# EAGLE design led-er-v3-module-c (EAGLE 7.5.0)
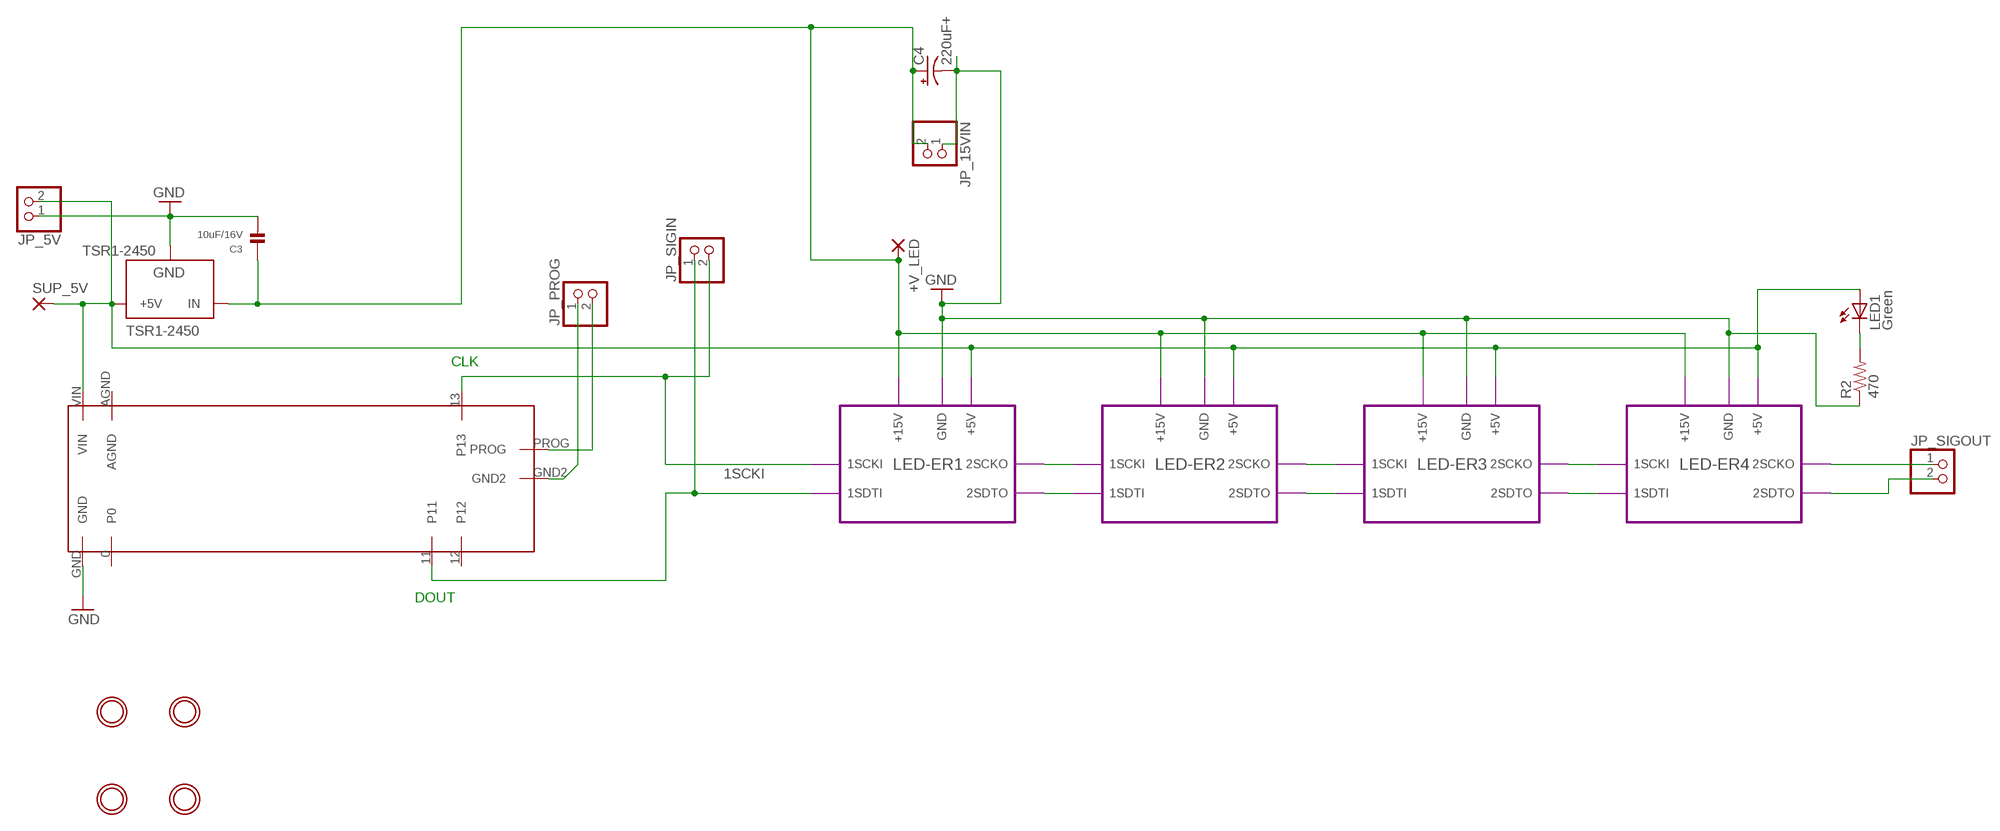
[diagram p0: schematic, sheet 1]

## Parts
+V_LED  3,17/1,1  [3,17/1,1]
C3  10uF/16V  CAP_CERAMIC0805  [0805]
C4  220uF+  CPOL-USE5-8.5  [E5-8,5]
JP_5V  HEADER-1X2  [1X02_OVAL]
JP_15VIN  HEADER-1X2  [1X02_OVAL]
JP_PROG  HEADER-1X2  [1X02_OVAL]
JP_SIGIN  HEADER-1X2  [1X02_OVAL]
JP_SIGOUT  HEADER-1X2  [1X02_OVAL]
LED1  Green  LED5MM  [LED5MM]
R2  470  RESISTOR_DUAL  [0805-THM]
SUP_5V  3,17/1,1  [3,17/1,1]
TSR1-2450  TSR1-2450  [TSR-1]
U$1  MOUNTINGHOLE  [MOUNTINGHOLE_3.0_PLATED]
U$2  MOUNTINGHOLE  [MOUNTINGHOLE_3.0_PLATED]
U$3  MOUNTINGHOLE  [MOUNTINGHOLE_3.0_PLATED]
U$4  MOUNTINGHOLE  [MOUNTINGHOLE_3.0_PLATED]
U$5  TEENSY_LEDER  [TEENSY_LEDER]

## Module instances
LED-ER1 = LED-ER
LED-ER2 = LED-ER
LED-ER3 = LED-ER
LED-ER4 = LED-ER

## Nets
1SCKI: JP_SIGIN.2 U$5.13 ; port LED-ER1.1SCKI
1SDTI: JP_SIGIN.1 U$5.11 ; port LED-ER1.1SDTI
+5V: JP_5V.2 LED1.A SUP_5V.1(P) TSR1-2450.3(+5V) U$5.VIN ; port LED-ER1.+5V LED-ER2.+5V LED-ER3.+5V LED-ER4.+5V
GND: C3.2 C4.- JP_5V.1 JP_15VIN.1 R2.1 TSR1-2450.2(GND) U$5.GND ; port LED-ER1.GND LED-ER2.GND LED-ER3.GND LED-ER4.GND
N$1: LED1.K(C) R2.2
N$2: port LED-ER1.2SCKO LED-ER2.1SCKI
N$3: port LED-ER1.2SDTO LED-ER2.1SDTI
N$4: port LED-ER2.2SCKO LED-ER3.1SCKI
N$5: port LED-ER2.2SDTO LED-ER3.1SDTI
N$6: port LED-ER3.2SCKO LED-ER4.1SCKI
N$7: port LED-ER3.2SDTO LED-ER4.1SDTI
N$8: JP_SIGOUT.1 ; port LED-ER4.2SCKO
N$9: JP_SIGOUT.2 ; port LED-ER4.2SDTO
N$54: JP_PROG.1 U$5.GND2
N$55: JP_PROG.2 U$5.PROG
VIN: +V_LED.1(P) C3.1 C4.+ JP_15VIN.2 TSR1-2450.1(IN) ; port LED-ER1.+15V LED-ER2.+15V LED-ER3.+15V LED-ER4.+15V
Unconnected: U$5.0 U$5.12 U$5.AGND

## Notes on the sheet
- CLK
- DOUT

## Library data of the parts
+V_LED SUP_5V = wirepad:3,17/1,1: THROUGH-HOLE PAD
C3 = microbuilder:CAP_CERAMIC: Ceramic Capacitors 0402 - 0402 Surface Mount Capacitors 16pF 50V 5% [Digikey: 445-4899-2-ND] 18pF 50V 5% [Digikey: 490-1281-2-ND] 22pF 50V 5% [Digikey: 490-1283-2-ND] 68pF 50V 5% [Digikey: 490-1289-2-ND] 0.1uF 10V 10% [Digikey: 490-1318-2-ND] 1.0uF 6.3V 10% [Digikey: 490-1320-2-ND] 0603 - 0603 Surface Mount Capacitors 16 pF 50V 5% [Digikey: 445-5051-2-ND] 22 pF 50V [Digikey: PCC220ACVTR-ND] 33 pF 50V 5% [Digikey: 490-1415-1-ND] 56pF 50V 5% [Digikey: 490-1421-1-ND] 220pF 50V 5% [Digikey: 445-1285-1-ND] 680 pF 50V 2200 pF 50V 5% C0G [Digikey: 445-1297-1-ND] 5600 pF 100V 5% X7R [Digikey: 478-3711-1-ND] 0.1 µF 25V 10% [Digikey: PCC2277TR-ND] 0.22 µF 16V 10% X7R [Digikey: 445-1318-1-ND] 1.0 µF 25V 10% [Digikey: 445-5146-2-ND] 0603 - RF Specific 3pF 250V +/-0.1pF RF [Digikey: 712-1347-1-ND] 18 pF 250V 5% [Digikey: 478-3505-1-ND or 712-1322-1-ND] 56 pF 250V 5% C0G RF [Digikey: 490-4867-1-ND] 68 pF 250V RF [Digikey: 490-4868-1-ND] 0805 - 0805 Surface Mount Capacitors 220 pF 250V 2% RF Ceramic Capacitor [Digikey: 712-1398-1-ND] 1000 pF 50V 2% NP0 Ceramic Capacitor [Digikey: 478-3760-1-ND] 0.1 µF 25V 10% Ceramic Capacitor [Digikey: PCC1828TR-ND] 1.0 µF 16V 10% Ceramic Capacitor[Digikey: 490-1691-2-ND] 10.0 µF 10V 10% Ceramic Capacitor[Digikey: 709-1228-1-ND] 10.0 uF 16V 10% Ceramic Capacitor [Digikey: 478-5165-2-ND] 47 uF 6.3V 20% Ceramic Capacitor [Digikey: 587-1779-1-ND or 399-5506-1-ND] 1206 - 1206 Surface Mount Capacitors 47uF 10V 20% Ceramic Capacitor [Digikey: 490-5528-1-ND or 399-5508-1-ND or 445-6010-1-ND] 100uF 6.3V -20%, +80% Y5V Ceramic Capacitor (Digikey: 490-4512-1-ND, Mouser: 81-GRM31CF50J107ZE1L)
C4 = adafruit:CPOL-US: POLARIZED CAPACITOR, American symbol
JP_5V JP_15VIN JP_PROG JP_SIGIN JP_SIGOUT = microbuilder:HEADER-1X2: PIN HEADER
LED1 = adafruit:LED: LED OSRAM: - CHIPLED LG R971, LG N971, LY N971, LG Q971, LY Q971, LO R971, LY R971 LH N974, LH R974 LS Q976, LO Q976, LY Q976 LO Q996 - Hyper CHIPLED LW Q18S LB Q993, LB Q99A, LB R99A - SideLED LS A670, LO A670, LY A670, LG A670, LP A670 LB A673, LV A673, LT A673, LW A673 LH A674 LY A675 LS A676, LA A676, LO A676, LY A676, LW A676 LS A679, LY A679, LG A679 - Hyper Micro SIDELED® LS Y876, LA Y876, LO Y876, LY Y876 LT Y87S - SmartLED LW L88C, LW L88S LB L89C, LB L89S, LG L890 LS L89K, LO L89K, LY L89K LS L896, LA L896, LO L896, LY L896 - TOPLED LS T670, LO T670, LY T670, LG T670, LP T670 LSG T670, LSP T670, LSY T670, LOP T670, LYG T670 LG T671, LOG T671, LSG T671 LB T673, LV T673, LT T673, LW T673 LH T674 LS T676, LA T676, LO T676, LY T676, LB T676, LH T676, LSB T676, LW T676 LB T67C, LV T67C, LT T67C, LS T67K, LO T67K, LY T67K, LW E67C LS E67B, LA E67B, LO E67B, LY E67B, LB E67C, LV E67C, LT E67C LW T67C LS T679, LY T679, LG T679 LS T770, LO T770, LY T770, LG T770, LP T770 LB T773, LV T773, LT T773, LW T773 LH T774 LS E675, LA E675, LY E675, LS T675 LS T776, LA T776, LO T776, LY T776, LB T776 LHGB T686 LT T68C, LB T68C - Hyper Mini TOPLED® LB M676 - Mini TOPLED Santana® LG M470 LS M47K, LO M47K, LY M47K Source: http://www.osram.convergy.de/
R2 = microbuilder:RESISTOR_DUAL: Flip Flop resistor An 0805 resistor inside a standard 1/4W 5% resistor. Makes for easy mods Footprint taken from the Adafruit Industries Eagle Library.
TSR1-2450 = SteelCaveRobotics-Power:TSR1-2450: Traco Power TSR 1-2450 5.0v switching regulator
U$1-U$4 = microbuilder:MOUNTINGHOLE: Mounting Hole For #2 screws (0.086"/2.18mm width, 0.094"/2.4mm hole) use 2.5mm
U$5 = Andrews:TEENSY_LEDER

## Module LED-ER
Ports: 1SCKI(io) 1SDTI(io) 2SCKO(io) 2SDTO(io) +15V(io) GND(io) +5V(io)
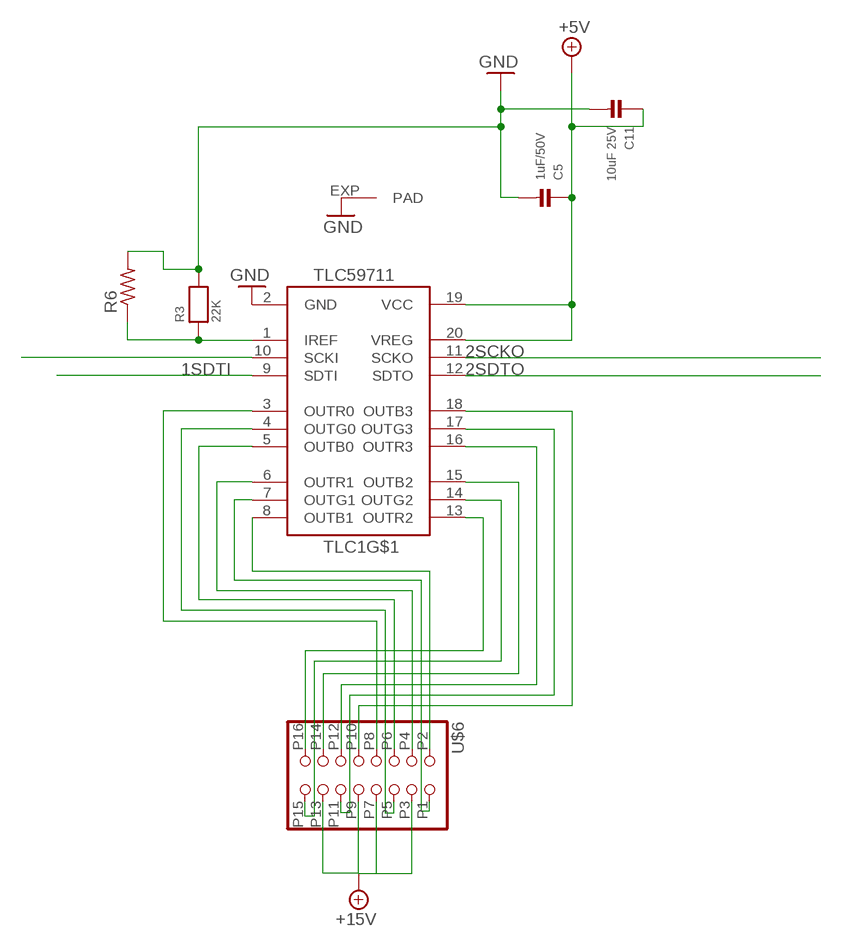
[diagram p1: schematic, module LED-ER, sheet 1]

### Parts
C5  1uF/50V  CAP_CERAMIC0805  [0805]
C11  10uF 25V  CAP_CERAMIC0805  [0805]
R3  22K  RESISTOR0805  [0805]
R6  R-US_0207/9  [0207/9]
TLC1  TLC59711  [HTSSOP20DAP]
U$6  HEADER-2X8-RIBBON  [2X08_RIBBON]

### Nets
1SCKI: TLC1.10(SCKI)
1SDTI: TLC1.9(SDTI)
2SCKO: TLC1.11(SCKO)
2SDTO: TLC1.12(SDTO)
+5V: C5.1 C11.1 TLC1.19(VCC) TLC1.20(VREG)
+15V: U$6.P3 U$6.P7 U$6.P9 U$6.P13
B0: TLC1.5(OUTB0) U$6.P6
B1: TLC1.8(OUTB1) U$6.P2
B2: TLC1.15(OUTB2) U$6.P14
B3: TLC1.18(OUTB3) U$6.P10
G0: TLC1.4(OUTG0) U$6.P5
G1: TLC1.7(OUTG1) U$6.P1
G2: TLC1.14(OUTG2) U$6.P15
G3: TLC1.17(OUTG3) U$6.P11
GND: C5.2 C11.2 R3.2 R6.2 TLC1.2(GND) TLC1.EXP(PAD)
IREF: R3.1 R6.1 TLC1.1(IREF)
R0: TLC1.3(OUTR0) U$6.P8
R1: TLC1.6(OUTR1) U$6.P4
R2: TLC1.13(OUTR2) U$6.P16
R3: TLC1.16(OUTR3) U$6.P12

### Library data of the parts
C5 C11 = microbuilder:CAP_CERAMIC: Ceramic Capacitors 0402 - 0402 Surface Mount Capacitors 16pF 50V 5% [Digikey: 445-4899-2-ND] 18pF 50V 5% [Digikey: 490-1281-2-ND] 22pF 50V 5% [Digikey: 490-1283-2-ND] 68pF 50V 5% [Digikey: 490-1289-2-ND] 0.1uF 10V 10% [Digikey: 490-1318-2-ND] 1.0uF 6.3V 10% [Digikey: 490-1320-2-ND] 0603 - 0603 Surface Mount Capacitors 16 pF 50V 5% [Digikey: 445-5051-2-ND] 22 pF 50V [Digikey: PCC220ACVTR-ND] 33 pF 50V 5% [Digikey: 490-1415-1-ND] 56pF 50V 5% [Digikey: 490-1421-1-ND] 220pF 50V 5% [Digikey: 445-1285-1-ND] 680 pF 50V 2200 pF 50V 5% C0G [Digikey: 445-1297-1-ND] 5600 pF 100V 5% X7R [Digikey: 478-3711-1-ND] 0.1 µF 25V 10% [Digikey: PCC2277TR-ND] 0.22 µF 16V 10% X7R [Digikey: 445-1318-1-ND] 1.0 µF 25V 10% [Digikey: 445-5146-2-ND] 0603 - RF Specific 3pF 250V +/-0.1pF RF [Digikey: 712-1347-1-ND] 18 pF 250V 5% [Digikey: 478-3505-1-ND or 712-1322-1-ND] 56 pF 250V 5% C0G RF [Digikey: 490-4867-1-ND] 68 pF 250V RF [Digikey: 490-4868-1-ND] 0805 - 0805 Surface Mount Capacitors 220 pF 250V 2% RF Ceramic Capacitor [Digikey: 712-1398-1-ND] 1000 pF 50V 2% NP0 Ceramic Capacitor [Digikey: 478-3760-1-ND] 0.1 µF 25V 10% Ceramic Capacitor [Digikey: PCC1828TR-ND] 1.0 µF 16V 10% Ceramic Capacitor[Digikey: 490-1691-2-ND] 10.0 µF 10V 10% Ceramic Capacitor[Digikey: 709-1228-1-ND] 10.0 uF 16V 10% Ceramic Capacitor [Digikey: 478-5165-2-ND] 47 uF 6.3V 20% Ceramic Capacitor [Digikey: 587-1779-1-ND or 399-5506-1-ND] 1206 - 1206 Surface Mount Capacitors 47uF 10V 20% Ceramic Capacitor [Digikey: 490-5528-1-ND or 399-5508-1-ND or 445-6010-1-ND] 100uF 6.3V -20%, +80% Y5V Ceramic Capacitor (Digikey: 490-4512-1-ND, Mouser: 81-GRM31CF50J107ZE1L)
R3 = microbuilder:RESISTOR: Resistors 0402 - 0402 Surface Mount Package 22 Ohm 1% 1/16W [Digikey: 311-22.0LRTR-ND] 33 Ohm 5% 1/16W 1.0K 5% 1/16W 1.5K 5% 1/16W 2.0K 1% 1/16W 10.0K 1% 1/16W [Digikey: 311-10.0KLRTR-ND] 10.0K 5% 1/16W [Digikey: RMCF0402JT10K0TR-ND] 12.1K 1% 1/16W [Digikey: 311-22.0LRTR-ND] 100.0K 5% 1/16W 0603 - 0603 Surface Mount Package 0 Ohm 1/10 Watt 1% Resistor 15 Ohm 1/10 Watt 1% Resistor 33 Ohm 1/10 Watt 1% Resistor 49.9 Ohm 1/10 Watt 1% Resistor 100 Ohm 1/10 Watt 1% Resistor 150 Ohm 1/10 Watt 1% Resistor 240 Ohm 1/10 Watt 1% Resistor 390 Ohm 1/10 Watt 1% Resistor 560 Ohm 1/10 Watt 1% Resistor 680 Ohm 1/10 Watt 1% Resistor 750 Ohm 1/10 Watt 1% Resistor 1.0K Ohm 1/10 Watt 1% Resistor 1.5K Ohm 1/10 Watt 1% Resistor 2.0K Ohm 1/10 Watt 1% Resistor 2.2K Ohm 1/10 Watt 1% Resistor 3.3K Ohm 1/10 Watt 1% Resistor 4.7K Ohm 1/10 Watt 1% Resistor 10.0K Ohm 1/10 Watt 1% Resistor 12.0K Ohm 1/10 Watt 1% Resistor 12.1K Ohm 1/10 Watt 1% Resistor 20.0K Ohm 1/10 Watt 1% Resistor 33.0K Ohm 1/10 Watt 1% Resistor 100.0K Ohm 1/10 Watt 1% Resistor 0805 - 0805 Surface Mount Package 0 Ohm 1/8 Watt 1% Resistor 33 Ohm 1/8 Watt 1% Resistor 100 Ohm 1/8 Watt 1% Resistor 150 Ohm 1/8 Watt 1% Resistor 200 Ohm 1/8 Watt 1% Resistor 240 Ohm 1/8 Watt 1% Resistor 330 Ohm 1/8 Watt 1% Resistor 390 Ohm 1/8 Watt 1% Resistor 470 Ohm 1/8 Watt 1% Resistor 1.0K Ohm 1/8 Watt 1% Resistor 1.5K Ohm 1/8 Watt 1% Resistor 2.0K Ohm 1/8 Watt 1% Resistor 4.7K Ohm 1/8 Watt 1% Resistor 5.1K Ohm 1/8 Watt 1% Resistor 5.6K Ohm 1/8 Watt 1% Resistor 10.0K Ohm 1/8 Watt 1% Resistor 22.0K Ohm 1/8 Watt 1% Resistor 33.0K Ohm 1/8 Watt 1% Resistor 100K Ohm 1/8 Watt 1% Resistor 1206 - 1206 Surface Mount Package 2012 - 2010 Surface Mount Package 0.11 Ohm 1/2 Watt 1% Resistor - Digikey: RHM.11UCT-ND
R6 = adafruit:R-US_: RESISTOR, American symbol
TLC1 = adafruit:TLC59711
U$6 = Andrews:HEADER-2X8-RIBBON

## Board
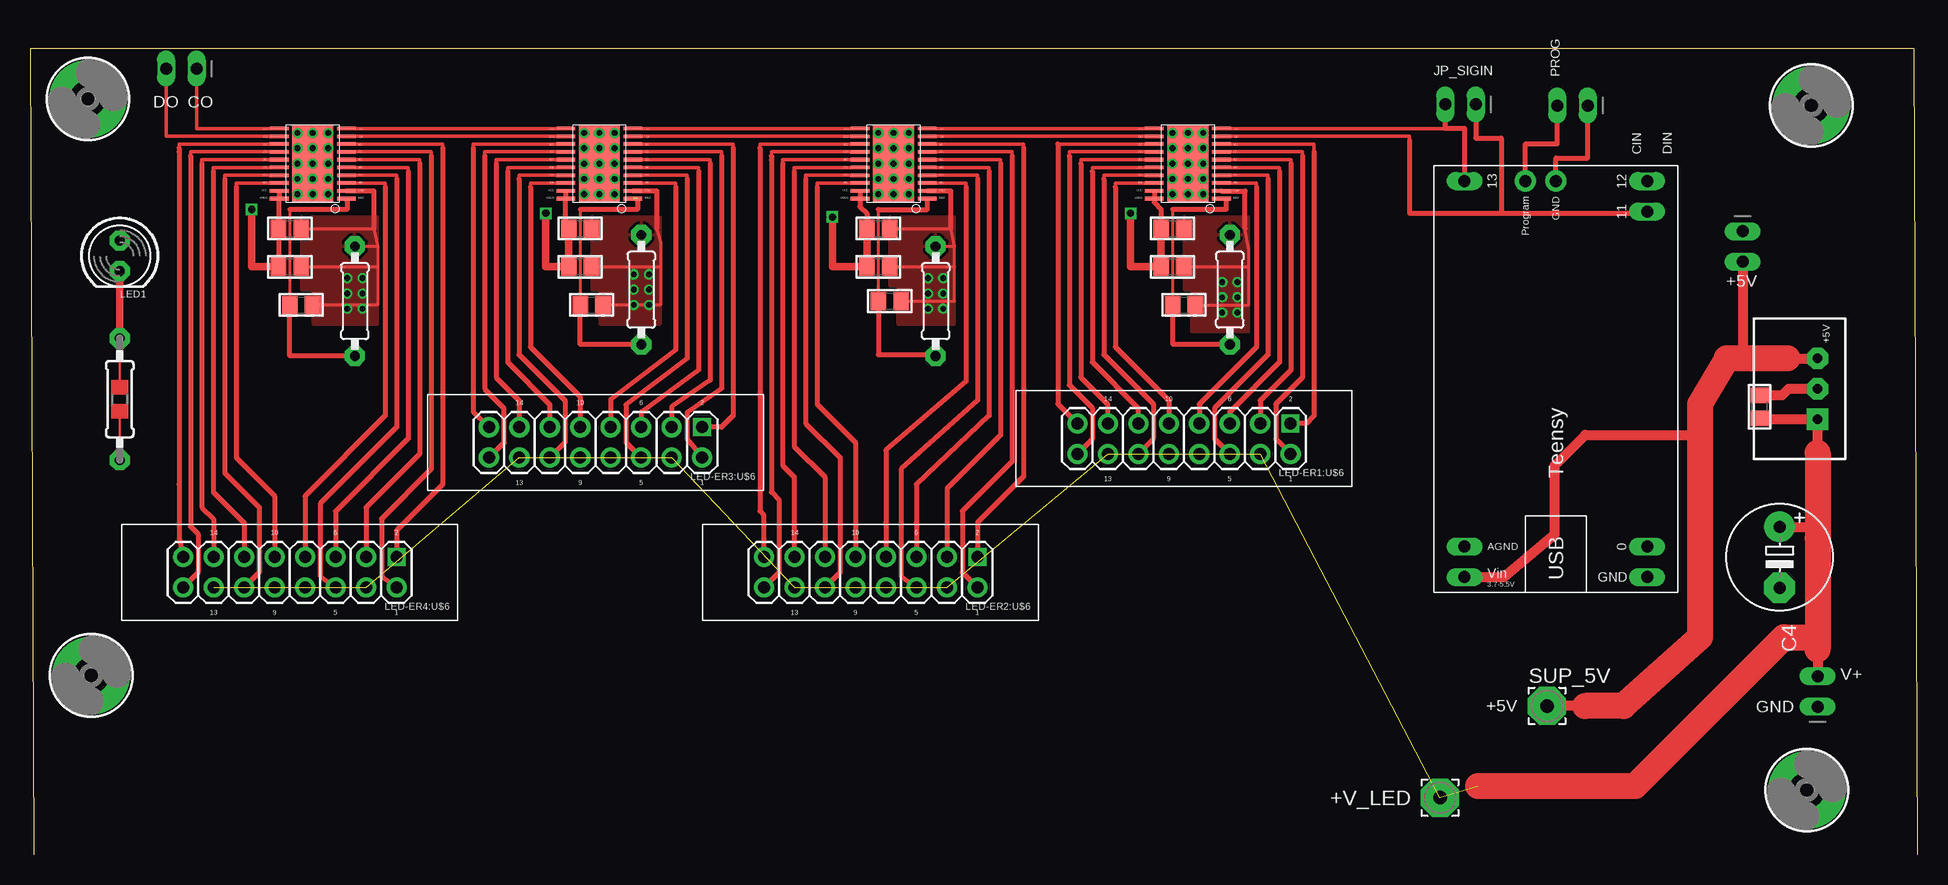
[diagram p2: board, top side]
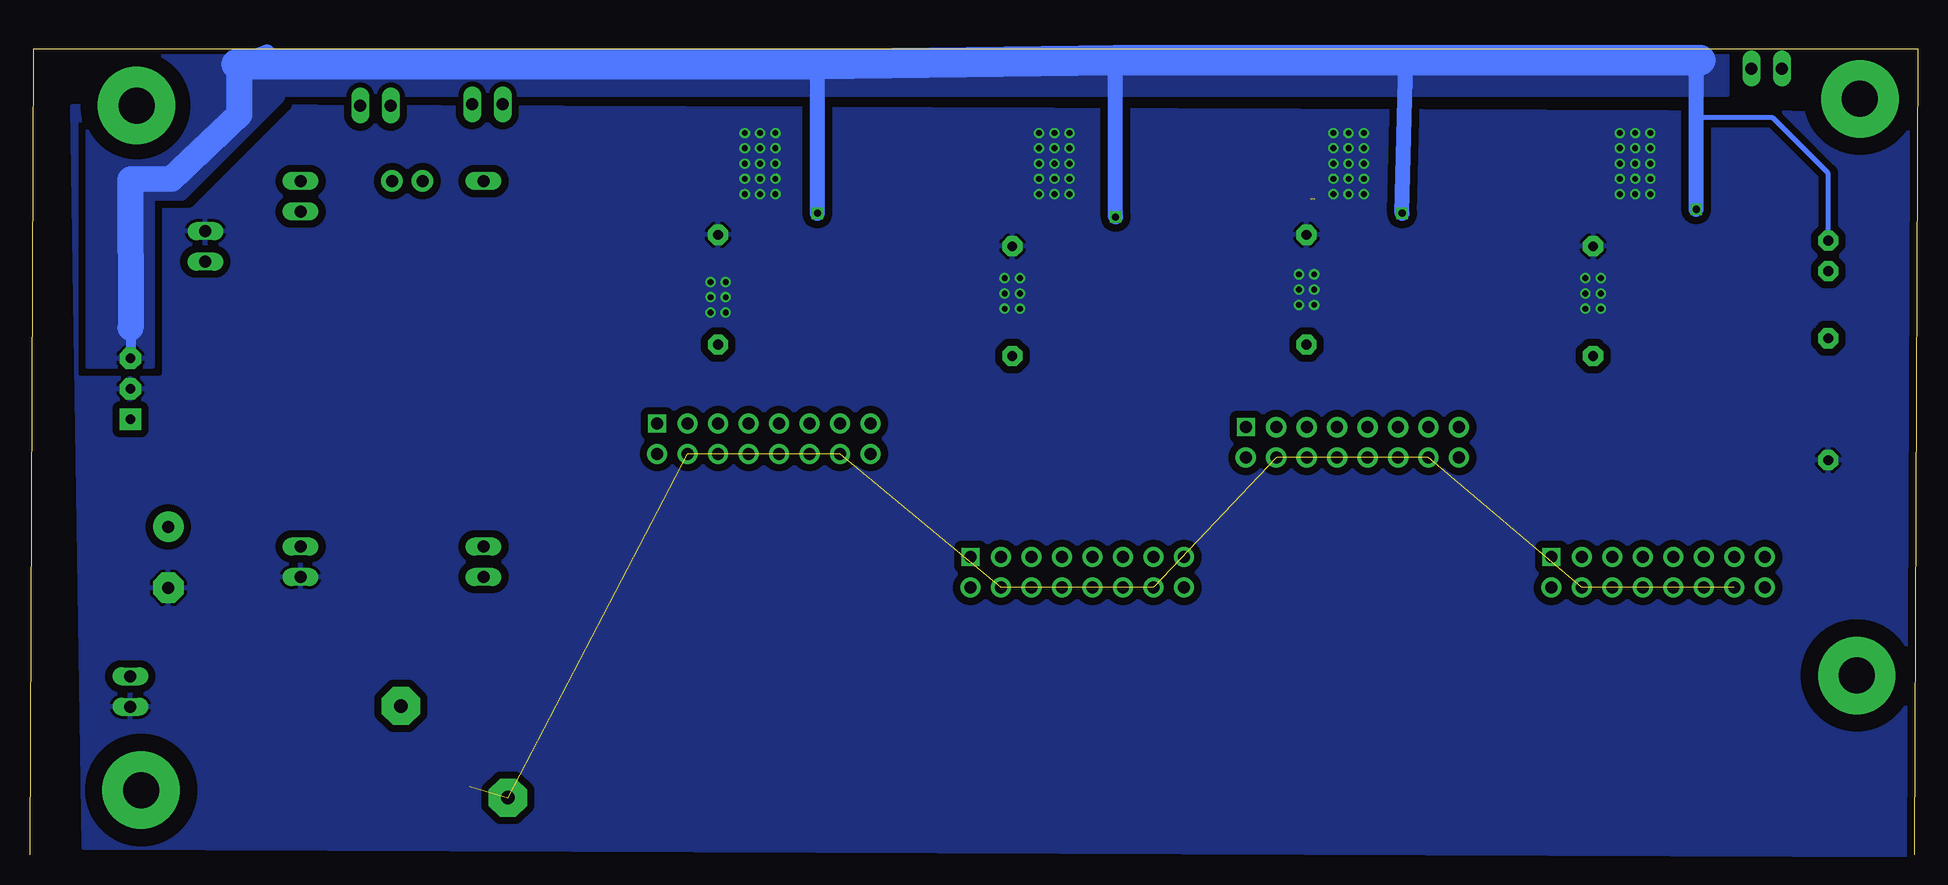
[diagram p3: board, bottom side, seen from below]

Size 157.37 x 67.25 mm. Coordinates in mm from the lower left corner, seen from the top.
Outline: 157.37,0 157.05,67.25 0,67.25 0.32,0
Copper layers (1*16): Top 0.0356mm / dielectric 1.5011mm / Bottom 0.0356mm
Design rules "LaenPCBOrder": minimum track width 6mil, minimum drill 13mil, track to track 6mil, track to pad 6mil, pad to pad 6mil, via to via 6mil, smd to smd 6mil, copper to edge 15mil, drill to drill 6mil, minimum pad ring 7mil, minimum via ring 7mil, stop-mask expansion 3mil, vias tented up to drill 0mil, thermal gap 10mil
tRestrict: area 20.7,23.3 to 21.3,24.8; area 69.8,22.6 to 70.4,23.6

### Footprints (pad centres in the part's own frame; a part is rotated, then mirrored left to right if it is on the bottom)
3,17/1,1 = drill 1.118 pad 3.175 octagon: 1 0,0
0805 = smd 1.3 x 1.5: 1 -0.95,0; 2 0.95,0
E5-8,5 = drill 1.016 pad 2.54: + -2.54,0 | drill 1.016 pad 2.54 octagon: - 2.54,0
1X02_OVAL = drill 1 long: 1 -1.27,0; 2 1.27,0
LED5MM = drill 0.813 pad 1.676 octagon: A -1.27,0; K 1.27,0
0207/9 = drill 0.813 pad 1.676 octagon: 1 -4.572,0; 2 4.572,0
HTSSOP20DAP = smd 0.3 x 1.55: 1 -2.925,-2.8; 2 -2.275,-2.8; 3 -1.625,-2.8; 4 -0.975,-2.8; 5 -0.325,-2.8; 6 0.325,-2.8; 7 0.975,-2.8; 8 1.625,-2.8; 9 2.275,-2.8; 10 2.925,-2.8; 11 2.925,2.8; 12 2.275,2.8; 13 1.625,2.8; 14 0.975,2.8; 15 0.325,2.8; 16 -0.325,2.8; 17 -0.975,2.8; 18 -1.625,2.8; 19 -2.275,2.8; 20 -2.925,2.8 | smd 6.5 x 3.4: EXP 0,0
2X08_RIBBON = drill 1 pad 1.676: P1 -8.89,1.27; P3 -6.35,1.27; P4 -6.35,-1.27; P5 -3.81,1.27; P6 -3.81,-1.27; P7 -1.27,1.27; P8 -1.27,-1.27; P9 1.27,1.27; P10 1.27,-1.27; P11 3.81,1.27; P12 3.81,-1.27; P13 6.35,1.27; P14 6.35,-1.27; P15 8.89,1.27; P16 8.89,-1.27 | drill 1 square: P2 -8.89,-1.27
0805-THM = drill 0.813 pad 1.676 octagon: 1 -5.08,0; 2 5.08,0
TSR-1 = drill 0.8 pad 1.8 square: 1 -2.54,-1.5 | drill 0.8 pad 1.8 octagon: 2 0,-1.5; 3 2.54,-1.5
MOUNTINGHOLE_3.0_PLATED = drill 3 pad 6.452: P$1 0,0
TEENSY_LEDER = drill 1 pad 1.422 long: 0 12.7,7.62; 11 -15.24,7.62; 12 -17.78,7.62; 13 -17.78,-7.62; AGND 12.7,-7.62; GND 15.24,7.62; VIN 15.24,-7.62 | drill 1 pad 1.778: GND2 -17.78,0; PROG -17.78,-2.54

### Placement (x,y rotation side)
+V_LED  117.53,4.78 0 top
C3  144.17,37.37 90 top
C4  145.84,24.82 270 top
JP_5V  142.76,50.73 270 top
JP_15VIN  149,13.64 90 top
JP_PROG  128.57,62.49 180 top
JP_SIGIN  119.23,62.59 180 top
JP_SIGOUT  12.62,65.57 180 top
LED1  7.48,49.95 270 top
LED-ER1:C5  1uF/50V  [0805]  95.24,52.24 0 top
LED-ER1:C11  10uF 25V  [0805]  95.24,49.05 0 top
LED-ER1:R3  22K  [0805]  96.19,45.87 0 top
LED-ER1:R6  [0207/9]  100.01,47.14 90 top
LED-ER1:TLC1  TLC59711  [HTSSOP20DAP]  96.51,57.65 90 top
LED-ER1:U$6  HEADER-2X8-RIBBON  [2X08_RIBBON]  96.19,34.72 180 top
LED-ER2:C5  1uF/50V  [0805]  70.71,52.24 0 top
LED-ER2:C11  10uF 25V  [0805]  70.71,49.05 0 top
LED-ER2:R3  22K  [0805]  71.67,46.18 0 top
LED-ER2:R6  [0207/9]  75.49,46.18 90 top
LED-ER2:TLC1  TLC59711  [HTSSOP20DAP]  71.98,57.65 90 top
LED-ER2:U$6  HEADER-2X8-RIBBON  [2X08_RIBBON]  70.07,23.57 180 top
LED-ER3:C5  1uF/50V  [0805]  45.87,49.05 0 top
LED-ER3:C11  10uF 25V  [0805]  45.87,52.24 0 top
LED-ER3:R3  22K  [0805]  46.82,45.87 0 top
LED-ER3:R6  [0207/9]  50.96,47.14 90 top
LED-ER3:TLC1  TLC59711  [HTSSOP20DAP]  47.46,57.65 90 top
LED-ER3:U$6  HEADER-2X8-RIBBON  [2X08_RIBBON]  47.14,34.4 180 top
LED-ER4:C5  1uF/50V  [0805]  21.66,49.05 0 top
LED-ER4:C11  10uF 25V  [0805]  21.66,52.24 0 top
LED-ER4:R3  22K  [0805]  22.61,45.87 0 top
LED-ER4:R6  [0207/9]  27.07,46.18 90 top
LED-ER4:TLC1  TLC59711  [HTSSOP20DAP]  23.57,57.65 90 top
LED-ER4:U$6  HEADER-2X8-RIBBON  [2X08_RIBBON]  21.66,23.57 180 top
R2  7.48,38.01 90 top
SUP_5V  126.45,12.42 0 top
TSR1-2450  147.5,38.86 90 top
U$1  148.48,62.5 0 top
U$2  5.1,14.97 0 top
U$3  4.83,63.05 0 top
U$4  148.11,5.41 0 top
U$5  127.19,38.42 270 top

### Tracks (layer width: path | path; a pad name or v marks a point on that pad's centre or on a via)
1SCKI
  Top 0.305: LED-ER1:TLC1.10 117.96,60.58
  Top 0.406: U$5.13 119.57,60.58 117.96,60.58 JP_SIGIN.2
1SDTI
  Top 0.305: LED-ER1:TLC1.9 114.98,59.93 114.98,59.56 | 134.81,53.51 U$5.11
  Top 0.406: JP_SIGIN.1 120.5,59.78 122.63,59.78 122.63,53.51 | 114.98,59.56 114.98,53.51 122.63,53.51 | 122.63,53.51 134.81,53.51
+5V  (via drill 0.6)
  Top 0.254: LED-ER1:TLC1.20 | LED-ER3:TLC1.20 44.92,54.73 | LED-ER4:TLC1.20 20.71,54.73 | LED-ER2:C5.1 | LED-ER3:C11.1
  Top 0.305: LED-ER1:C5.1 | LED-ER2:C5.1 | LED-ER4:TLC1.19 20.77,55.24 | LED-ER3:TLC1.19 44.66,55.26 | LED-ER2:TLC1.19 | LED-ER2:TLC1.19 69.18,55.27 | LED-ER1:TLC1.19 | LED-ER1:TLC1.19 93.71,55.28
  Top 0.406: LED-ER4:C5.1 LED-ER4:C11.1 20.77,52.24 LED-ER4:TLC1.20 20.77,55.24 | LED-ER1:C5.1 94.28,53.83 93.71,54.4 LED-ER1:TLC1.20 93.71,55.28 | LED-ER2:C5.1 69.75,53.51 69.18,54.08 LED-ER2:TLC1.20 69.18,55.27 | LED-ER3:C11.1 44.66,52.24 LED-ER3:TLC1.20 44.66,55.26 | 69.18,55.27 | 93.71,55.28 | LED-ER1:C11.1 | LED-ER2:C11.1
  Top 0.61: v91.73,53.51 91.73,49.05 LED-ER1:C11.1 LED-ER1:C5.1 | v66.89,53.19 66.89,49.05 LED-ER2:C11.1 LED-ER2:C5.1 | LED-ER3:C11.1 LED-ER3:C5.1 43,49.05 v43,53.51 | LED-ER4:C5.1 18.47,49.05 v18.47,53.83
  Top 0.813: U$5.VIN 122.87,23.18 127.09,26.75 127.09,32.49 129.64,35.04 138.87,35.04 | 143.39,41.66 143.65,41.4 | 129.64,12.42 SUP_5V.1 | TSR1-2450.3 146.52,41.4 146.52,41.41 | JP_5V.2 142.76,41.66 143.01,41.4
  Top 1.422: 138.87,35.04 139.19,35.04 | 146.52,41.41 146.52,41.4
  Top 2.184: 129.64,12.42 132.82,12.42 139.19,18.16 139.19,35.04 139.19,37.59 141.42,41.4 143.01,41.4 143.65,41.4 146.52,41.4
  Bottom 0.406: LED1.A 7.48,56.85 12.1,61.47 18.47,61.47
  Bottom 0.813: 148.99,43.95 TSR1-2450.3
  Bottom 1.016: 18.47,66.57 18.16,66.25
  Bottom 1.27: v91.73,53.51 91.73,65.93 | v66.89,53.19 66.89,66.25 | v43,53.51 42.68,66.25 | v18.47,53.83 18.47,61.47 18.47,66.57
  Bottom 1.422: 137.6,66.89 140.15,65.93 139.91,65.91 | 149.07,41.47 TSR1-2450.3
  Bottom 2.184: 139.91,65.91 139.91,61.77 145.56,56.38 148.99,56.35 148.99,43.95
  Bottom 2.54: 140.15,65.93 91.73,65.93 66.89,66.25 42.68,66.25 18.16,66.25
  pour Bottom (isolate 0.406): 15.93,63.38 140.78,63.38 141.1,67.53 15.93,67.53
  pour Bottom (isolate 0.406): 136.32,67.53 152.57,67.53 152.57,40.77 147.15,40.77 147.15,54.78 144.61,54.78 136.32,63.07
GND  (via drill 0.48)  (3 unrouted)
  Top 0.254: LED-ER1:TLC1.2 | LED-ER1:R3.2 101.6,45.87 101.6,49.05 | 101.6,49.05 101.6,50.44 101.28,52.24 | LED-ER2:C5.2 | LED-ER2:R3.2 77.08,46.19 77.08,49.05 | 77.08,49.05 77.08,50.76 | 77.08,50.76 76.76,52.24 LED-ER2:C5.2 | LED-ER2:R6.2 77.08,50.76 | 52.24,52.24 52.56,51.08 52.56,49.05 | 52.56,49.05 52.56,45.87 v51.6,45.87 v50.33,45.87 LED-ER3:R3.2 | LED-ER3:R3.2 | 28.98,50.76 28.67,52.24 LED-ER4:C11.2 | 28.98,50.76 28.98,49.05 | 28.98,49.05 28.98,45.87 LED-ER4:R3.2 | LED-ER4:R6.2 28.98,50.76 | LED-ER4:C5.2 28.98,49.05 | LED-ER3:C5.2 52.56,49.05 | LED-ER2:C11.2 77.08,49.05 | LED-ER1:C11.2 101.6,49.05
  Top 0.305: 28.67,55.38 28.66,55.32 | 52.24,55.38 52.24,55.32 | 101.28,55.37 101.28,55.31
  Top 0.406: 101.28,52.24 101.28,55.31 | 76.76,52.24 76.76,55.38 LED-ER2:TLC1.2 | 52.24,55.32 52.24,52.24 | 28.66,55.32 28.67,52.24 | LED-ER4:TLC1.2 28.67,55.38 | LED-ER3:TLC1.2 52.24,55.38 | LED-ER1:TLC1.2 101.28,55.37
  Top 0.813: TSR1-2450.2 146.58,38.86 146.04,38.32 C3.2
  other vias: 22.3,60.2 23.57,60.2 24.84,60.2 22.3,58.93 23.57,58.93 22.3,57.65 23.57,57.65 24.84,57.65 22.3,56.38 23.57,56.38 24.84,56.38 22.3,55.1 23.57,55.1 24.84,55.1 24.84,58.93 95.24,60.2 96.51,60.2 97.78,60.2 95.24,58.93 96.51,58.93 97.78,58.93 95.24,57.65 96.51,57.65 97.78,57.65 95.24,56.38 96.51,56.38 97.78,56.38 95.24,55.1 96.51,55.1 97.78,55.1 70.71,60.2 71.98,60.2 73.26,60.2 70.71,58.93 71.98,58.93 73.26,58.93 70.71,57.65 71.98,57.65 73.26,57.65 70.71,56.38 71.98,56.38 73.26,56.38 70.71,55.1 71.98,55.1 73.26,55.1 46.18,60.2 47.46,60.2 48.73,60.2 46.18,58.93 47.46,58.93 46.18,57.65 47.46,57.65 48.73,57.65 46.18,56.38 47.46,56.38 48.73,56.38 46.18,55.1 47.46,55.1 48.73,55.1 48.73,58.93 26.44,48.1 26.44,46.82 27.71,46.82 26.44,45.55 27.71,45.55 27.71,48.1 50.33,48.41 51.6,48.41 50.33,47.14 51.6,47.14 74.85,48.1 74.85,46.82 74.85,45.55 76.13,45.55 76.13,46.82 76.13,48.1 99.38,47.78 100.65,47.78 99.38,46.5 100.65,46.5 99.38,45.23 100.65,45.23
  pour Top: 96.19,53.19 96.19,47.14 96.83,47.14 96.83,43.64 101.61,43.64 101.61,53.19
  pour Top: 71.67,53.19 71.67,47.46 72.3,47.46 72.3,44.27 77.08,44.27 77.08,53.19
  pour Top: 46.82,47.14 47.46,47.14 47.46,44.27 52.56,44.27 52.56,53.19 46.82,53.19
  pour Top: 22.61,53.19 22.61,47.14 23.57,47.14 23.57,44.27 28.98,44.27 28.98,53.19
  pour Bottom (isolate 0.61, rank 2): 0.32,61.79 153.84,62.43 152.89,0.64 0.32,0
LED-ER1:B0
  Top 0.305: LED-ER1:TLC1.5 104.15,57.33 104.15,57.01
  Top 0.406: 104.15,57.01 104.15,41.09 100.01,36.95 100.01,36 LED-ER1:U$6.P6
LED-ER1:B1
  Top 0.305: LED-ER1:TLC1.8 107.02,59.28 107.02,58.29
  Top 0.406: 107.02,58.64 107.02,58.29 107.02,36.63 106.38,35.99 LED-ER1:U$6.P2
LED-ER1:B2
  Top 0.305: LED-ER1:TLC1.15 87.59,57.98 87.59,57.66
  Top 0.406: 87.59,57.66 87.59,39.81 89.82,37.59 89.82,36.01 LED-ER1:U$6.P14
LED-ER1:B3
  Top 0.305: LED-ER1:TLC1.18 90.46,56.03 90.46,55.71
  Top 0.406: 90.46,55.71 90.46,42.36 94.92,37.9 LED-ER1:U$6.P10
LED-ER1:G0
  Top 0.305: LED-ER1:TLC1.4 103.2,56.68 103.2,56.36
  Top 0.406: 103.2,56.36 103.2,41.73 98.74,37.27 98.74,34.71 LED-ER1:U$6.P5
LED-ER1:G1
  Top 0.305: LED-ER1:TLC1.7 106.07,58.63 106.07,58.31
  Top 0.406: 106.07,58.31 106.07,39.81 103.84,37.59 103.84,34.69 LED-ER1:U$6.P1
LED-ER1:G2
  Top 0.305: LED-ER1:TLC1.14 86.64,58.63 86.64,58.31
  Top 0.406: 86.64,58.31 86.64,39.18 88.55,37.27 88.55,34.69 LED-ER1:U$6.P15
LED-ER1:G3
  Top 0.305: LED-ER1:TLC1.17 89.5,56.68 89.5,56.36
  Top 0.406: 89.5,56.36 89.5,41.73 93.64,37.59 93.64,34.71 LED-ER1:U$6.P11
LED-ER1:IREF
  Top 0.254: LED-ER1:TLC1.1 99.7,54.73 | 95.24,53.83 LED-ER1:R3.1 | 100.01,42.62 LED-ER1:R6.1
  Top 0.305: 99.7,54.73 99.69,54.73 99.69,54.61
  Top 0.406: 95.24,53.83 99.7,53.83 99.7,54.61 99.69,54.61 | LED-ER1:R3.1 95.24,42.62 100.01,42.62
LED-ER1:R0
  Top 0.305: LED-ER1:TLC1.3 102.24,56.03 102.24,55.71
  Top 0.406: 102.24,55.71 102.24,42.36 97.47,37.59 LED-ER1:U$6.P8
LED-ER1:R1
  Top 0.305: LED-ER1:TLC1.6 105.11,57.98 105.11,57.66
  Top 0.406: 105.11,57.66 105.11,40.45 102.56,37.9 102.56,36.01 LED-ER1:U$6.P4
LED-ER1:R2
  Top 0.305: LED-ER1:TLC1.13 85.68,59.28
  Top 0.406: 85.68,59.28 85.68,37.61 LED-ER1:U$6.P16
LED-ER1:R3
  Top 0.305: LED-ER1:TLC1.16 88.55,57.33 88.55,57.01
  Top 0.406: 88.55,57.01 88.55,41.09 92.37,37.27 LED-ER1:U$6.P12
LED-ER2:B0
  Top 0.305: LED-ER2:TLC1.5 79.95,57.33 79.95,56.7
  Top 0.406: 79.95,57.01 79.95,56.7 79.95,36.63 73.9,30.9 73.9,27.72 LED-ER2:U$6.P6
LED-ER2:B1
  Top 0.305: LED-ER2:TLC1.8 82.81,59.28 82.81,58.96
  Top 0.406: 82.81,58.96 82.81,31.56 78.99,27.73 LED-ER2:U$6.P2
LED-ER2:B2
  Top 0.305: LED-ER2:TLC1.15 62.75,57.98 62.75,57.66
  Top 0.406: 62.75,57.66 62.75,32.49 63.7,31.53 63.7,24.86 LED-ER2:U$6.P14
LED-ER2:B3
  Top 0.305: LED-ER2:TLC1.18 65.61,56.03 65.61,55.71
  Top 0.406: 65.61,55.71 65.61,37.59 68.8,34.4 LED-ER2:U$6.P10
LED-ER2:G0
  Top 0.305: LED-ER2:TLC1.4 78.99,56.68 78.99,56.38
  Top 0.406: 78.99,56.38 78.99,37.9 72.62,32.17 72.62,23.24 LED-ER2:U$6.P5
LED-ER2:G1
  Top 0.305: LED-ER2:TLC1.7 81.86,58.63 81.86,57.97
  Top 0.406: 81.86,58.31 81.86,57.97 81.86,32.81 77.72,28.67 77.72,23.55 LED-ER2:U$6.P1
LED-ER2:G2
  Top 0.305: LED-ER2:TLC1.14 61.79,58.63 61.79,57.97
  Top 0.406: LED-ER2:U$6.P15 62.43,23.55 62.43,29.62 61.79,30.26 61.79,57.97 61.79,58.31
LED-ER2:G3
  Top 0.305: LED-ER2:TLC1.17 64.66,56.68 64.66,56.06
  Top 0.406: 64.66,56.36 64.66,56.06 64.66,35.99 67.53,33.13 67.53,23.56 LED-ER2:U$6.P11
LED-ER2:IREF
  Top 0.254: 70.71,53.83 LED-ER2:R3.1 | 75.49,41.73 LED-ER2:R6.1
  Top 0.305: LED-ER2:TLC1.1 74.79,54.58
  Top 0.406: 70.71,53.83 74.78,53.83 74.78,54.58 74.79,54.58 | LED-ER2:R3.1 70.71,41.73 75.49,41.73
LED-ER2:R0
  Top 0.305: LED-ER2:TLC1.3 78.04,56.03 78.04,55.42
  Top 0.406: 78.04,55.71 78.04,55.42 78.04,39.5 71.35,33.76 71.35,27.71 LED-ER2:U$6.P8
LED-ER2:R1
  Top 0.305: LED-ER2:TLC1.6 80.9,57.98 80.9,57.66
  Top 0.406: 80.9,57.66 80.9,35.04 76.44,30.58 76.44,27.73 LED-ER2:U$6.P4
LED-ER2:R2
  Top 0.305: LED-ER2:TLC1.13 60.84,59.28 60.84,58.96
  Top 0.406: 60.84,58.96 60.84,28.67 61.16,28.35 61.16,24.87 LED-ER2:U$6.P16
LED-ER2:R3
  Top 0.305: LED-ER2:TLC1.16 63.7,57.33 63.7,57.01
  Top 0.406: 63.7,57.01 63.7,34.08 66.25,31.53 66.25,24.85 LED-ER2:U$6.P12
LED-ER3:B0
  Top 0.305: LED-ER3:TLC1.5 55.74,57.33 55.74,57.01
  Top 0.406: 55.74,57.01 55.74,40.45 50.97,36.95 50.95,36.94 LED-ER3:U$6.P6
LED-ER3:B1
  Top 0.305: LED-ER3:TLC1.8 58.61,59.28 58.61,58.96
  Top 0.406: 58.61,58.96 58.61,36.63 57.65,35.67 LED-ER3:U$6.P2
LED-ER3:B2
  Top 0.305: LED-ER3:TLC1.15 38.86,57.98 38.86,57.66
  Top 0.406: 38.86,57.66 38.86,39.81 40.77,37.9 40.77,35.69 LED-ER3:U$6.P14
LED-ER3:B3
  Top 0.305: LED-ER3:TLC1.18 41.73,56.03 41.73,55.71
  Top 0.406: 41.73,55.71 41.73,42.36 45.87,38.22 LED-ER3:U$6.P10
LED-ER3:G0
  Top 0.305: LED-ER3:TLC1.4 54.78,56.68 54.78,56.36
  Top 0.406: 54.78,56.36 54.78,41.41 49.67,37.54 49.69,34.39 LED-ER3:U$6.P5
LED-ER3:G1
  Top 0.305: LED-ER3:TLC1.7 57.65,58.63 57.65,58.31
  Top 0.406: 57.65,58.31 57.65,38.9 54.78,36.91 54.78,34.69 LED-ER3:U$6.P1
LED-ER3:G2
  Top 0.305: LED-ER3:TLC1.14 37.9,58.63 37.9,58.31
  Top 0.406: LED-ER3:U$6.P15 39.53,34.38 39.5,34.41 39.5,37.27 37.9,38.86 37.9,58.31
LED-ER3:G3
  Top 0.305: LED-ER3:TLC1.17 40.77,56.68 40.77,56.36
  Top 0.406: 40.77,56.36 40.77,41.73 44.59,37.9 44.59,34.39 LED-ER3:U$6.P11
LED-ER3:IREF  (1 unrouted)
  Top 0.254: 45.87,53.83 LED-ER3:R3.1
  Top 0.305: 50.64,54.73 50.65,54.73 50.65,54.54
  Top 0.406: 45.87,53.83 50.64,53.83 50.64,54.54 50.65,54.54 | LED-ER3:R6.1 45.87,42.57 LED-ER3:R3.1
LED-ER3:R0
  Top 0.305: LED-ER3:TLC1.3 53.83,56.03 53.83,55.71
  Top 0.406: 53.83,55.71 53.83,42.11 48.41,37.98 LED-ER3:U$6.P8
LED-ER3:R1
  Top 0.305: LED-ER3:TLC1.6 56.7,57.98 56.7,57.66
  Top 0.406: 56.7,57.66 56.7,39.59 53.49,37.38 LED-ER3:U$6.P4
LED-ER3:R2
  Top 0.305: LED-ER3:TLC1.13 36.95,59.28 36.95,58.96
  Top 0.406: 36.95,58.96 36.95,36.97 LED-ER3:U$6.P16
LED-ER3:R3
  Top 0.305: LED-ER3:TLC1.16 39.81,57.33 39.81,56.7
  Top 0.406: 39.81,57.01 39.81,56.7 39.81,41.09 43.33,37.57 LED-ER3:U$6.P12
LED-ER4:B0
  Top 0.305: LED-ER4:TLC1.5 31.53,57.33 31.53,57.01
  Top 0.406: 31.53,57.01 31.53,34.72 25.47,28.65 LED-ER4:U$6.P6
LED-ER4:B1
  Top 0.305: LED-ER4:TLC1.8 34.4,59.28 34.4,58.96
  Top 0.406: 34.4,58.96 34.4,30.9 30.55,27.05 LED-ER4:U$6.P2
LED-ER4:B2
  Top 0.305: LED-ER4:TLC1.15 14.33,57.98 14.33,57.66
  Top 0.406: 14.33,57.66 14.33,28.98 15.31,28.01 LED-ER4:U$6.P14
LED-ER4:B3
  Top 0.305: LED-ER4:TLC1.18 17.2,56.03 17.2,55.71
  Top 0.406: 17.2,55.71 17.2,33.13 20.39,29.94 LED-ER4:U$6.P10
LED-ER4:G0
  Top 0.305: LED-ER4:TLC1.4 30.58,56.68 30.58,56.36
  Top 0.406: 30.58,56.36 30.58,35.67 24.21,29.3 24.21,23.24 LED-ER4:U$6.P5
LED-ER4:G1
  Top 0.305: LED-ER4:TLC1.7 33.44,58.63 33.44,58.31
  Top 0.406: 33.44,58.31 33.44,32.17 29.3,28.03 29.3,23.23 LED-ER4:U$6.P1
LED-ER4:G2
  Top 0.305: LED-ER4:TLC1.14 13.38,58.63 13.38,58.31
  Top 0.406: 13.38,58.31 13.38,27.39 14.01,26.75 14.01,23.57 12.77,22.32 LED-ER4:U$6.P15
LED-ER4:G3
  Top 0.305: LED-ER4:TLC1.17 16.24,56.68 16.24,56.36
  Top 0.406: 16.24,56.36 16.24,31.85 19.11,28.98 19.11,23.57 LED-ER4:U$6.P11
LED-ER4:IREF
  Top 0.254: LED-ER4:TLC1.1 26.44,54.73 | 21.66,53.83 LED-ER4:R3.1
  Top 0.305: 26.44,54.73 26.44,54.53
  Top 0.406: 21.66,53.83 26.44,53.83 26.44,54.53 | LED-ER4:R6.1 21.66,41.61 LED-ER4:R3.1
LED-ER4:R0
  Top 0.305: LED-ER4:TLC1.3 29.62,56.03 29.62,55.71
  Top 0.406: 29.62,55.71 29.62,36.63 22.93,29.94 LED-ER4:U$6.P8
LED-ER4:R1
  Top 0.305: LED-ER4:TLC1.6 32.49,57.98 32.49,57.66
  Top 0.406: 32.49,57.66 32.49,33.44 28.01,28.96 LED-ER4:U$6.P4
LED-ER4:R2
  Top 0.305: LED-ER4:TLC1.13 12.42,59.28 12.42,58.61
  Top 0.406: 12.42,58.96 12.42,58.61 12.42,30.9 12.45,26.41 LED-ER4:U$6.P16
LED-ER4:R3
  Top 0.305: LED-ER4:TLC1.16 15.29,57.33 15.29,57.01
  Top 0.406: 15.29,57.01 15.29,30.26 17.85,27.7 LED-ER4:U$6.P12
N$1
  Top 0.305: R2.2
  Top 0.61: LED1.K R2.2
N$2
  Top 0.305: LED-ER2:TLC1.10 LED-ER1:TLC1.11 | LED-ER1:TLC1.11
N$3
  Top 0.305: LED-ER2:TLC1.9 LED-ER1:TLC1.12 | LED-ER1:TLC1.12
N$4
  Top 0.305: LED-ER2:TLC1.11 LED-ER3:TLC1.10
N$5
  Top 0.305: LED-ER3:TLC1.9 LED-ER2:TLC1.12
N$6
  Top 0.305: LED-ER3:TLC1.11 LED-ER4:TLC1.10
N$7
  Top 0.305: LED-ER4:TLC1.9 LED-ER3:TLC1.12
N$8
  Top 0.305: JP_SIGOUT.1 13.89,60.58 LED-ER4:TLC1.11
N$9
  Top 0.305: LED-ER4:TLC1.12 11.35,59.93 JP_SIGOUT.2
N$54
  Top 0.305: JP_PROG.1
  Top 0.406: U$5.GND2 127.19,58.11 129.85,58.11 JP_PROG.1
N$55
  Top 0.305: JP_PROG.2
  Top 0.406: U$5.PROG 124.65,59.3 127.31,59.3 JP_PROG.2
VIN  (17 unrouted)
  Top 0.61: LED-ER2:U$6.P3 76.42,22 76.44,21.98
  Top 0.813: C3.1 144.27,36.32 TSR1-2450.1 149,33.56 | 149,17.14 149,16.82 JP_15VIN.2 | C4.+ 148.97,27.36 149,26.44
  Top 2.184: 120.72,5.73 133.78,5.73 146.2,18.16 148.69,18.16 149,18.47 | 149,33.56 149,26.44 149,18.47 | 149,18.47 149,17.14

### Text on the board
tPlace: PROG | DO | CO | CIN | DIN | +5V | V+ | +5V | GND